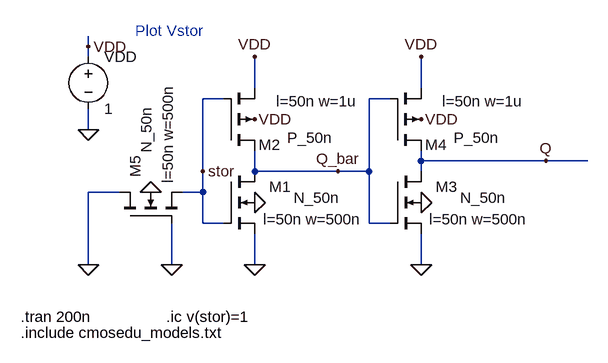
[diagram p0: schematic Fig14_7.asc]
Fig14_7.asc, the LTspice schematic file:
Version 4
SHEET 1 3172 680
WIRE 192 -368 192 -384
WIRE 192 -352 192 -368
WIRE 448 -304 448 -352
WIRE 704 -304 704 -352
WIRE 400 -288 368 -288
WIRE 656 -288 624 -288
WIRE 192 -240 192 -272
WIRE 704 -192 704 -208
WIRE 896 -192 704 -192
WIRE 960 -192 896 -192
WIRE 368 -176 368 -288
WIRE 448 -176 448 -208
WIRE 576 -176 448 -176
WIRE 624 -176 624 -288
WIRE 624 -176 576 -176
WIRE 704 -176 704 -192
WIRE 240 -144 192 -144
WIRE 368 -144 368 -176
WIRE 368 -144 336 -144
WIRE 368 -96 368 -144
WIRE 400 -96 368 -96
WIRE 624 -96 624 -176
WIRE 656 -96 624 -96
WIRE 192 -32 192 -144
WIRE 320 -32 320 -96
WIRE 448 -32 448 -80
WIRE 704 -32 704 -80
FLAG 448 -128 0
FLAG 192 -240 0
FLAG 192 -368 VDD
FLAG 448 -256 VDD
FLAG 448 -32 0
FLAG 448 -352 VDD
FLAG 704 -128 0
FLAG 704 -256 VDD
FLAG 704 -32 0
FLAG 704 -352 VDD
FLAG 192 -32 0
FLAG 896 -192 Q
FLAG 576 -176 Q_bar
FLAG 320 -32 0
FLAG 288 -144 0
FLAG 368 -176 stor
SYMBOL nmos4 400 -176 R0
WINDOW 0 104 24 Right 2
WINDOW 3 179 41 Right 2
WINDOW 123 213 74 Right 2
SYMATTR InstName M1
SYMATTR Value N_50n
SYMATTR Value2 l=50n w=500n
SYMBOL voltage 192 -368 R0
WINDOW 123 0 0 Left 2
WINDOW 39 0 0 Left 2
SYMATTR InstName VDD
SYMATTR Value 1
SYMBOL pmos4 400 -208 M180
WINDOW 0 88 9 Right 2
WINDOW 3 168 20 Right 2
WINDOW 123 206 76 Right 2
SYMATTR InstName M2
SYMATTR Value P_50n
SYMATTR Value2 l=50n w=1u
SYMBOL nmos4 656 -176 R0
WINDOW 0 104 24 Right 2
WINDOW 3 179 41 Right 2
WINDOW 123 213 74 Right 2
SYMATTR InstName M3
SYMATTR Value N_50n
SYMATTR Value2 l=50n w=500n
SYMBOL pmos4 656 -208 M180
WINDOW 0 88 9 Right 2
WINDOW 3 168 20 Right 2
WINDOW 123 206 76 Right 2
SYMATTR InstName M4
SYMATTR Value P_50n
SYMATTR Value2 l=50n w=1u
SYMBOL nmos4 240 -96 R270
WINDOW 0 104 24 Right 2
WINDOW 3 179 41 Right 2
WINDOW 123 213 74 Right 2
SYMATTR InstName M5
SYMATTR Value N_50n
SYMATTR Value2 l=50n w=500n
TEXT 88 48 Left 2 !.tran 200n
TEXT 88 72 Left 2 !.include cmosedu_models.txt
TEXT 264 -392 Left 2 ;Plot Vstor
TEXT 312 48 Left 2 !.ic v(stor)=1

The netlist it stands for:
* Fig14_7.asc
M1 Q_bar stor 0 0 N_50n l=50n w=500n
VDD VDD 0 1
M2 Q_bar stor VDD VDD P_50n l=50n w=1u
M3 Q Q_bar 0 0 N_50n l=50n w=500n
M4 Q Q_bar VDD VDD P_50n l=50n w=1u
M5 0 0 stor 0 N_50n l=50n w=500n
.model NMOS NMOS
.model PMOS PMOS
.lib standard.mos
.tran 200n
.include cmosedu_models.txt
* Plot Vstor
.ic v(stor)=1
.backanno
.end